# Altium project FMC_ADC_128CH_10B.PrjPCB (part 4 of 4)

## Sheet SPI_translators.SchDoc: FMC ADC 128CH 10B
size 420 x 297 mm; Author: G.Kasprowicz; CompanyName: WUT ISE; DrawnBy: G.Kasprowicz; Organization: WUT ISE; Address1: PW ISE; Address2: Nowowiejska 15/19 00-665 Warsaw; Address3: gkasprow@gmail.com; DocumentNumber: 8; Revision: 1; SheetNumber: 8; SheetTotal: 9; ModifiedBy: -; CheckedDate: -; Title2: SPi translators; DivGrp: WUT ISE; Designer: G.Kasprowicz; ModifiedDate: -; ProjectName: Sensor Box
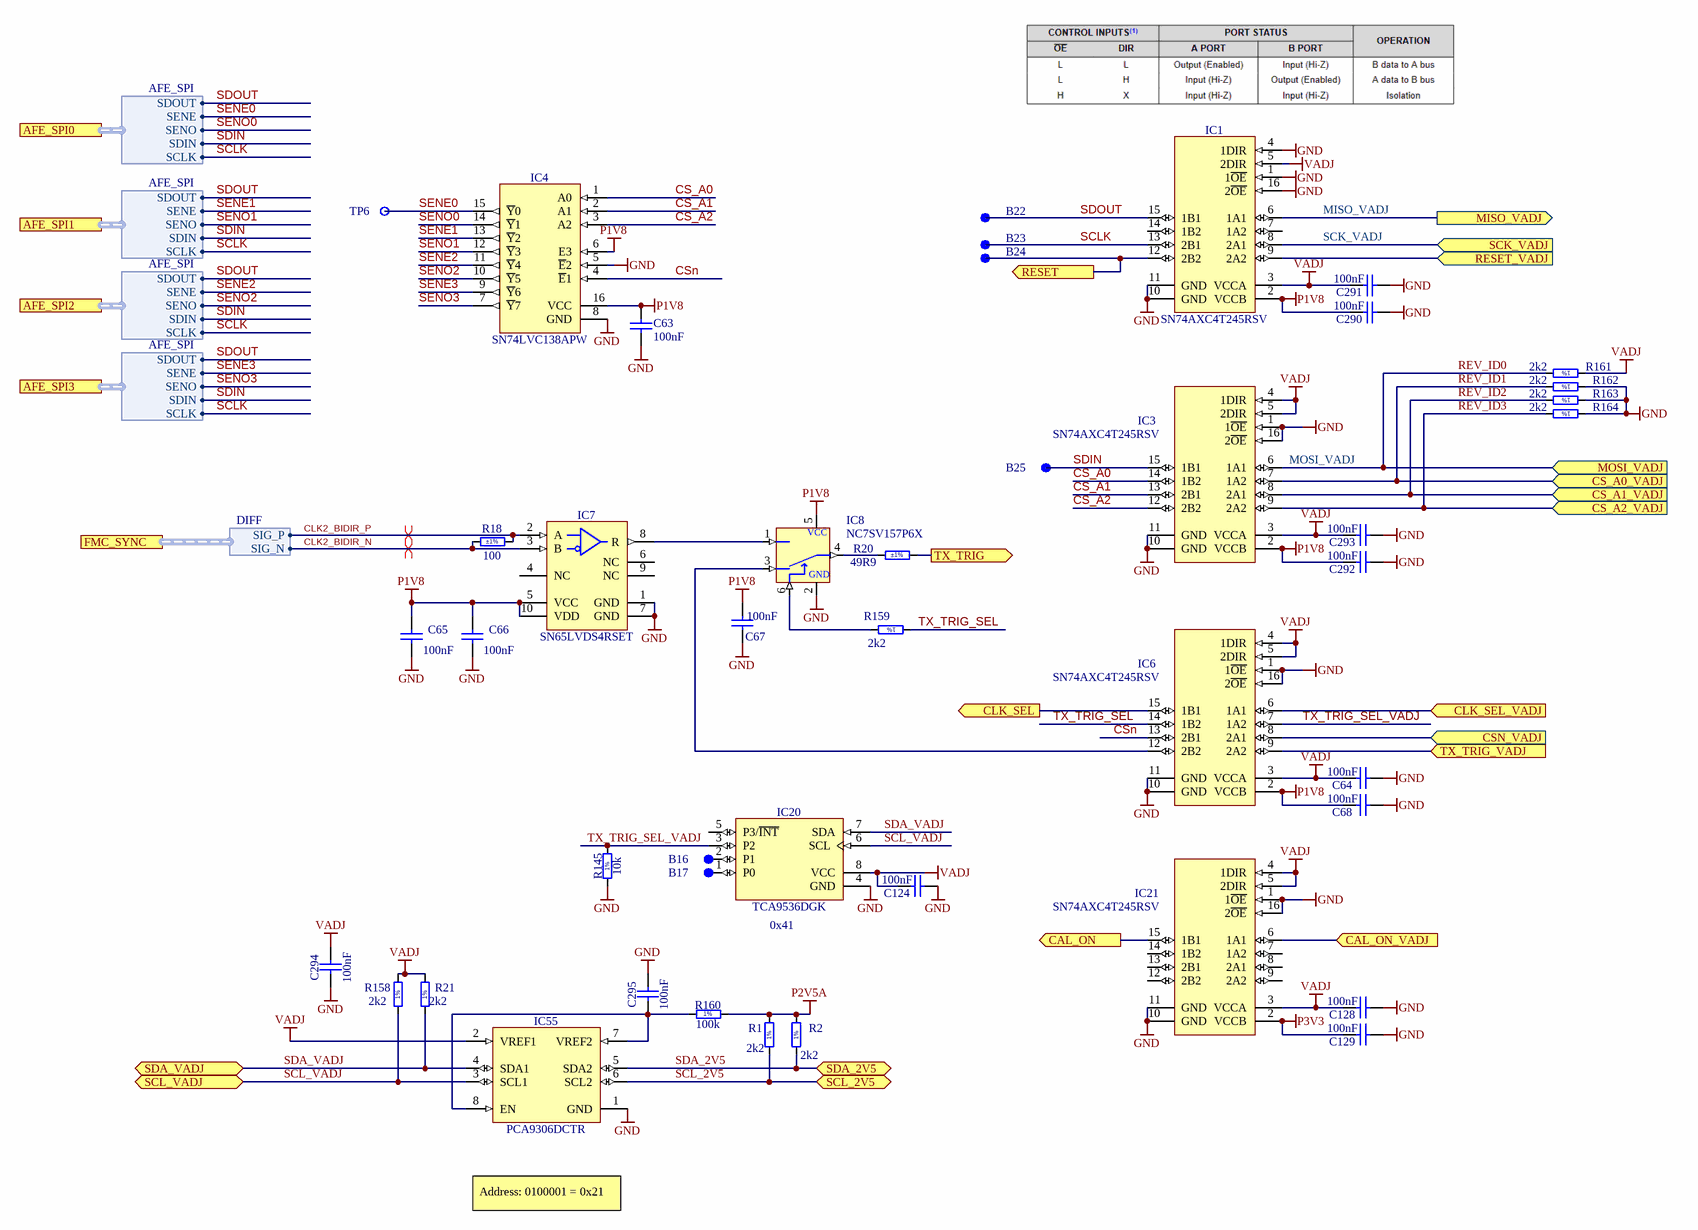
[diagram p7: SPI_translators.SchDoc]

### Parts
B16  SMD Pad  [C100]  (value not drawn)  (no BOM)
B17  SMD Pad  [C100]  (value not drawn)  (no BOM)
B22  SMD Pad  [C100]  (value not drawn)  (no BOM)
B23  SMD Pad  [C100]  (value not drawn)  (no BOM)
B24  SMD Pad  [C100]  (value not drawn)  (no BOM)
B25  SMD Pad  [C100]  (value not drawn)  (no BOM)
C63  100nF  [CAPC1005X55N]
C64  100nF  [CAPC0603X33N]
C65  100nF  [CAPC0603X33N]
C66  100nF  [CAPC0603X33N]
C67  100nF  [CAPC0603X33N]
C68  100nF  [CAPC0603X33N]
C124  100nF  [CAPC0603X33N]
C128  100nF  [CAPC0603X33N]
C129  100nF  [CAPC0603X33N]
C290  100nF  [CAPC0603X33N]
C291  100nF  [CAPC0603X33N]
C292  100nF  [CAPC0603X33N]
C293  100nF  [CAPC0603X33N]
C294  100nF  [CAPC0603X33N]
C295  100nF  [CAPC0603X33N]
IC1  SN74AXC4T245RSV  [QFN40P180X260X55-16N]
IC3  SN74AXC4T245RSV  [QFN40P180X260X55-16N]
IC4  SN74LVC138APW  [SOP65P640X110-16N]
IC6  SN74AXC4T245RSV  [QFN40P180X260X55-16N]
IC7  SN65LVDS4RSET  [TEXAS_RSE (R-PUQFN-N10)]
IC8  NC7SV157P6X  [SC70-6]
IC20  TCA9536DGK  [SOP65P490X110-8N]
IC21  SN74AXC4T245RSV  [QFN40P180X260X55-16N]
IC55  PCA9306DCTR  [SOP65P400X130-8N]
R1  2k2  [RESC1005X40N]
R2  2k2  [RESC1005X40N]
R18  100  Tolerance: ±1%  [RESC1005X40N]
R20  49R9  Tolerance: ±1%  [RESC1005X40N]
R21  2k2  [RESC1005X40N]
R145  10k  [RESC1005X40N]
R158  2k2  [RESC1005X40N]
R159  2k2  [RESC1005X40N]
R160  100k  [RESC1005X40N]
R161  2k2  [RESC1005X40N]
R162  2k2  [RESC1005X40N]
R163  2k2  [RESC1005X40N]
R164  2k2  [RESC1005X40N]
TP6  Test Point  [TPS127]  (value not drawn)  (no BOM)

### Ports
AFE_SPI0 (harness AFE_SPI), AFE_SPI1 (harness AFE_SPI), AFE_SPI2 (harness AFE_SPI), AFE_SPI3 (harness AFE_SPI), CAL_ON (out), CAL_ON_VADJ (in), CLK_SEL (out), CLK_SEL_VADJ (in), CS_A0_VADJ (in), CS_A1_VADJ (in), CS_A2_VADJ (in), CSN_VADJ (in), FMC_SYNC (harness DIFF), MISO_VADJ (out), MOSI_VADJ (in), RESET (out), RESET_VADJ (in), SCK_VADJ (in), SCL_2V5 (bidir), SCL_VADJ (bidir), SDA_2V5 (bidir), SDA_VADJ (bidir), TX_TRIG (out), TX_TRIG_VADJ (in)

### Harnesses
AFE_SPI: SDOUT, SENE, SENO, SDIN, SCLK
DIFF: SIG_P, SIG_N

### Nets
GND: C63.1 C64.2 C65.2 C66.2 C67.1 C68.2 C124.2 C128.2 C129.2 C290.2 C291.2 C292.2 C293.2 C294.1 C295.2 IC1.1(1~{OE}) IC1.4(1DIR) IC1.10(GND) IC1.11(GND) IC1.16(2~{OE}) IC3.1(1~{OE}) IC3.10(GND) IC3.11(GND) IC3.16(2~{OE}) IC4.5(~{E}2) IC4.8(GND) IC6.1(1~{OE}) IC6.10(GND) IC6.11(GND) IC6.16(2~{OE}) IC7.1(GND) IC7.7(GND) IC8.2(GND) IC20.4(GND) IC21.1(1~{OE}) IC21.10(GND) IC21.11(GND) IC21.16(2~{OE}) IC55.1(GND) R145.1 R162.1 R163.1 R164.1
P1V8: C63.2 C65.1 C66.1 C67.2 C68.1 C290.1 C292.1 IC1.2(VCCB) IC3.2(VCCB) IC4.6(E3) IC4.16(VCC) IC6.2(VCCB) IC7.5(VCC) IC7.10(VDD) IC8.5(Vcc)
P2V5A: R1.2 R2.2 R160.2
P3V3: C129.1 IC21.2(VCCB)
VADJ: C64.1 C124.1 C128.1 C291.1 C293.1 C294.2 IC1.3(VCCA) IC1.5(2DIR) IC3.3(VCCA) IC3.4(1DIR) IC3.5(2DIR) IC6.3(VCCA) IC6.4(1DIR) IC6.5(2DIR) IC20.8(VCC) IC21.3(VCCA) IC21.4(1DIR) IC21.5(2DIR) IC55.2(VREF1) R21.2 R158.2 R161.1
CAL_ON: IC21.15(1B1) ; port CAL_ON
CLK2_BIDIR_N: IC7.3(B) R18.1 ; port FMC_SYNC.SIG_N
CLK2_BIDIR_P: IC7.2(A) R18.2 ; port FMC_SYNC.SIG_P
CLK_SEL: IC6.15(1B1) ; port CLK_SEL
CS_A0: IC3.14(1B2) IC4.1(A0)
CS_A1: IC3.13(2B1) IC4.2(A1)
CS_A2: IC3.12(2B2) IC4.3(A2)
CSn: IC4.4(~{E}1) IC6.13(2B1)
HA19_P: IC6.8(2A1) ; port CSN_VADJ
HA22_N: IC1.9(2A2) ; port RESET_VADJ
HA23_P: IC6.9(2A2) ; port TX_TRIG_VADJ
HB20_N: IC21.6(1A1) ; port CAL_ON_VADJ
HB21_P: IC6.6(1A1) ; port CLK_SEL_VADJ
MISO_VADJ: IC1.6(1A1) ; port MISO_VADJ  [project net HA22_P]
MOSI_VADJ: IC3.6(1A1) R161.2 ; port MOSI_VADJ  [also labelled REV_ID0]  [project net HA21_P]
RESET: B24.1 IC1.12(2B2) ; port RESET
REV_ID1: IC3.7(1A2) R162.2 ; port CS_A0_VADJ  [project net HA19_N]
REV_ID2: IC3.8(2A1) R163.2 ; port CS_A1_VADJ  [project net HA20_P]
REV_ID3: IC3.9(2A2) R164.2 ; port CS_A2_VADJ  [project net HA20_N]
SCK_VADJ: IC1.8(2A1) ; port SCK_VADJ  [project net HA21_N]
SCL_2V5: IC55.6(SCL2) R1.1 ; port SCL_2V5
SCL_VADJ: IC20.6(SCL) IC55.3(SCL1) R158.1 ; port SCL_VADJ  [project net HB21_N]
SCLK: B23.1 IC1.13(2B1) ; port AFE_SPI0.SCLK, port AFE_SPI1.SCLK, port AFE_SPI2.SCLK, port AFE_SPI3.SCLK
SDA_2V5: IC55.5(SDA2) R2.1 ; port SDA_2V5
SDA_VADJ: IC20.7(SDA) IC55.4(SDA1) R21.1 ; port SDA_VADJ  [project net HB20_P]
SDIN: B25.1 IC3.15(1B1) ; port AFE_SPI0.SDIN, port AFE_SPI1.SDIN, port AFE_SPI2.SDIN, port AFE_SPI3.SDIN
SDOUT: B22.1 IC1.15(1B1) ; port AFE_SPI0.SDOUT, port AFE_SPI1.SDOUT, port AFE_SPI2.SDOUT, port AFE_SPI3.SDOUT
SENE0: IC4.15(~{Y}0) TP6.1 ; port AFE_SPI0.SENE  [project net SENE]
SENE1: IC4.13(~{Y}2) ; port AFE_SPI1.SENE  [project net SENE]
SENE2: IC4.11(~{Y}4) ; port AFE_SPI2.SENE  [project net SENE]
SENE3: IC4.9(~{Y}6) ; port AFE_SPI3.SENE  [project net SENE]
SENO0: IC4.14(~{Y}1) ; port AFE_SPI0.SENO  [project net SENO]
SENO1: IC4.12(~{Y}3) ; port AFE_SPI1.SENO  [project net SENO]
SENO2: IC4.10(~{Y}5) ; port AFE_SPI2.SENO  [project net SENO]
SENO3: IC4.7(~{Y}7) ; port AFE_SPI3.SENO  [project net SENO]
TX_TRIG: R20.2 ; port TX_TRIG
TX_TRIG_SEL: IC6.14(1B2) R159.1
TX_TRIG_SEL_VADJ: IC6.7(1A2) IC20.3(P2) R145.2
NetB16_1: B16.1 IC20.2(P1)
NetB17_1: B17.1 IC20.1(P0)
NetC295_1: C295.1 IC55.7(VREF2) IC55.8(EN) R160.1
NetIC6_12: IC6.12(2B2) IC8.3(I0)
NetIC7_8: IC7.8(R) IC8.1(I1)
NetIC8_4: IC8.4(Z) R20.1
NetIC8_6: IC8.6(S) R159.2

Not connected (* = marked no-connect by the designer): IC1 7(1A2) 14(1B2); IC7 4(NC) 6(NC) 9(NC); IC20 5(P3/~{INT}); IC21 7(1A2) 8(2A1) 9(2A2) 12(2B2) 13(2B1) 14(1B2)

### Layout directives
differential pair: CLK2_BIDIR_N, CLK2_BIDIR_P

### Notes on the sheet
- (near IC20) 0x41
- Address: 0100001 = 0x21
- Project/Equipment
- Document
- Designer
- Drawn by
- Check.by
- Copyright WUT ISE 2018.
  This documentation describes Open Hardware and is licensed under the CERN OHL v.1.1. You may redistribute and modify this documentation under the terms of the CERN OHL v.1.1. (http://ohwr.org/CERNOHL). This documentation is distributed WITHOUT ANY EXPRESS OR IMPLIED WARRANTY, INCLUDING OF MERCHANTABILITY, SATISFACTORY QUALITY AND FITNESS FOR A PARTICULAR PURPOSE. Please see the CERN OHL v.1.1 for applicable conditions.
- Contact
- File
- Last Mod.
- Print Date
- Sheet
- Size
- A3
- of
- Rev
- (in symbol 74_NC7SV157P6X) VCC
- (in symbol R0402_2K2_1%_0.0625W_100PPM) 1%
- (in symbol R0402_10K_1%_0.0625W_100PPM) 1%
- (in symbol R0402_100K_1%_0.0625W_100PPM) 1%

### Library data of the parts
B16 B17 B22-B25 = SMD_PAD_D1MM: Through Hole Pad; Part Description: 1mm Diameter SMD Pad; Mounted: No; Part Number: SMD_PAD_D1MM; Component Type: Standard (No BOM); Pin Count: 1; Family: SMD Pad; Socket: No; SMD: No; Sense: No; Status: None; ComponentHeight: 0mm; HelpURL: Undefined; Author: CERN DEM JLC; CreateDate: 10.10.2017; LatestRevisionDate: 10.10.2017; PackageDescription: 1mm Diameter SMD Pad
C63 = CC0402_100NF_16V_10%_X5R: Non-polarised capacitor; Part Description: SMD Multilayer Chip Ceramic Capacitor; Manufacturer: GENERIC; Manufacturer1 Part Number: GRM155R61C104KA88D; Voltage: 16V; TC: X5R; Tolerance: ±10%; Part Number: CC0402_100NF_16V_10%_X5R; Component Kind: Standard; Component Type: Standard; Pin Count: 2; Value: 100nF; Status: None; Manufacturer Part Number: CC0402_100NF_16V_10%_X5R; Case: 0402; Mounted: Yes; Socket: No; SMD: Yes; Sense: No; Manufacturer1 Example: MURATA; Manufacturer1 ComponentHeight: 0.55mm; HelpURL: \\cern.ch\dfs\Applications\Altium\Datasheets\CC0402_X5R_MURATA_GRM.pdf; Author: CERN DEM JLC; CreateDate: 10.12.2013; LatestRevisionDate: 10.12.2013
C64-C68 C124 C128 C129 C290-C295 = CC0201_100NF_6.3V_10%_X5R: Non-polarised capacitor; Manufacturer: GENERIC; Part Description: SMD Multilayer Chip Ceramic Capacitor; Manufacturer1 Part Number: 02016D104KAT2A; Tolerance: ±10%; Voltage: 6.3V; TC: X5R; Manufacturer Part Number: CC0201_100NF_6.3V_10%_X5R; Part Number: CC0201_100NF_6.3V_10%_X5R; Value: 100nF; Component Kind: Standard; Component Type: Standard; Pin Count: 2; Status: Not Recommended; Case: 0201; Mounted: Yes; Socket: No; SMD: Yes; Sense: No; Manufacturer1 Example: AVX; Manufacturer1 ComponentHeight: 0.33mm; HelpURL: \\cern.ch\dfs\Applications\Altium\Datasheets\CC0201_X5R_AVX.pdf; Author: CERN DEM JLC; CreateDate: 03.12.2007; LatestRevisionDate: 03.12.2007
IC1 IC3 IC6 IC21 = SN74AXC4T245: 4-Bit Dual-Supply Bus Transceiver with Configurable Voltage Translation and 3-State Output; Part Description: 4-Bit Dual-Supply Bus Transceiver With Configurable Voltage Translation and 3-State Outputs; Manufacturer: TEXAS INSTRUMENTS; PressFit: No; Bonding: No; Part Number: SN74AXC4T245RSV; Component Kind: Standard; Component Type: Standard; Device: SN74AXC4T245RSV; PackageDescription: QFN, 0.40mm Pitch, Rect.; 16 Pin, 2.60mm L X 1.80mm W X 0.55mm H Body, IPC Medium Density; Status: Recommended; Manufacturer Part Number: SN74AXC4T245RSV; Pin Count: 16; Case: QFN16; Mounted: Yes; Socket: No; SMD: Yes; Sense: No; ComponentHeight: 0.55mm; Author: GK; HelpURL: \\cern.ch\dfs\Applications\Altium\Datasheets\SN74AVC4T245RSVR.pdf; CreateDate: 08.07.2014; LatestRevisionDate: 30.03.2017
IC4 = SN74LVC138APW: 3-Line to 8-Line Decoder/Demultiplexer; Part Description: 3-Line to 8-Line Decoder/Demultiplexer, Inverting; Manufacturer: Texas Instruments; PressFit: No; Bonding: No; Part Number: SN74LVC138APW; Component Kind: Standard; Component Type: Standard; Device: SN74LVC138APW; PackageDescription: SOP, 0.65mm pitch; 16 pin, 4.40mm W X 5.00mm L X 1.10mm H body IPC Medium Density; Manufacturer Part Number: SN74LVC138APW; Pin Count: 16; Case: TSSOP16; Mounted: Yes; Socket: No; SMD: Yes; Sense: No; ComponentHeight: 1.1mm; Author: GK; HelpURL: \\cern.ch\dfs\Applications\Altium\Datasheets\74HC138PW.pdf; CreateDate: 09/06/2015; LatestRevisionDate: 09/06/2015
IC7 = SN65LVDS4RSET: 1.8V High-Speed Differential Line Receiver; Manufacturer: TEXAS INSTRUMENTS; PressFit: No; Bonding: No; Part Number: SN65LVDS4RSET; Component Kind: Standard; Component Type: Standard; Device: SN65LVDS4RSET; PackageDescription: QFN, TEXAS Case Style RSE (R-PUQFN-N10), 0.50mm Pitch; 10 Pin, 1.50mm W  X 2.00mm L X 0.60mm H body; Part Description: 1.8V High-Speed Differential Line Receiver; Manufacturer Part Number: SN65LVDS4RSET; Pin Count: 10; Case: QFN10; Mounted: Yes; Socket: No; SMD: Yes; Sense: No; ComponentHeight: 0.6mm; Author: CERN DEM JMW; HelpURL: \\cern.ch\dfs\Applications\Altium\Datasheets\SN65LVDS4RSET.pdf; CreateDate: 14.09.2015; LatestRevisionDate: 14.09.2015
IC8 = 74_NC7SV157P6X: TinyLogic ULP-A 2-Input Non-Inverting Multiplexer
IC20 = TCA9536DGK: Remote 4-Bit I2C and SMBus I/O Expander with Configuration Registers; Manufacturer: TEXAS INSTRUMENTS; PressFit: No; Bonding: No; Part Number: TCA9536DGK; Component Kind: Standard; Component Type: Standard; Device: TCA9536DGK; PackageDescription: SOP, 0.65mm Pitch; 8 Pin, 3.00mm W X 3.00mm L X 1.10mm H body, IPC Medium Density; Part Description: Remote 4-Bit I2C and SMBus I/O Expander with Configuration Registers; Manufacturer Part Number: TCA9536DGK; Pin Count: 8; Case: TSSOP8; Mounted: Yes; Socket: No; SMD: Yes; Sense: No; ComponentHeight: 1.1mm; Author: CERN DEM HF; HelpURL: \\cern.ch\dfs\Applications\Altium\Datasheets\TCA9536A.pdf; CreateDate: 20.01.2025; LatestRevisionDate: 20.01.2025
IC55 = PCA9306DCTR: Dual Bidirectional I2C Bus And SMBus Voltage-Level Translator; Manufacturer: TEXAS INSTRUMENTS; Table: Analog & Interface; Part Number: PCA9306DCTR; Component Kind: Standard; Component Type: Standard; Device: PCA9306DCTR; PackageDescription: SOP, 0.65mm, Pitch; 8 Pin, 2.80mm W X 2.95mm L X 1.30mm H Body, PC Medium Density; Part Description: Dual Bidirectional I2C Bus And SMBus Voltage-Level Translator; Manufacturer Part Number: PCA9306DCTR; Pin Count: 8; Case: SSOP8; Mounted: Yes; Socket: No; SMD: Yes; ComponentHeight: 1.3mm; Author: CERN DEM JLC; HelpURL: \\cern.ch\dfs\Applications\Altium\Datasheets\PCA9306DCTR.pdf; CreateDate: 2013-02-25; LatestRevisionDate: 2013-02-25
R1 R2 R21 R158 R159 R161-R164 = R0402_2K2_1%_0.0625W_100PPM: Resistor - 1%; Part Description: General Purpose Thick Film Chip Resistor; Manufacturer: GENERIC; Manufacturer1 Part Number: 232270672202L; TC: ±100ppm/°C; Table: Resistors SMD; Part Number: R0402_2K2_1%_0.0625W_100PPM; Component Kind: Standard; Component Type: Standard; Pin Count: 2; Value: 2k2; Status: Not recommended; Power: 0.0625W; Tolerance: ±1%; Manufacturer Part Number: R0402_2K2_1%_0.0625W_100PPM; Case: 0402; Mounted: Yes; Socket: No; SMD: Yes; Manufacturer1 Example: YAGEO PHYCOMP; Manufacturer1 ComponentHeight: 0.4mm; HelpURL: \\cern.ch\dfs\Applications\Altium\Datasheets\R0402_Phycomp_RC0402.pdf; Author: CERN DEM JLC; CreateDate: 2007-12-03; LatestRevisionDate: 2012-10-17
R18 = R0402_100R_1%_0.0625W_100PPM: Resistor - 1%; Part Description: General Purpose Thick Film Chip Resistor; Manufacturer: GENERIC; Manufacturer1 Part Number: 232270671001L; TC: ±100ppm/°C; PressFit: No; Part Number: R0402_100R_1%_0.0625W_100PPM; Component Kind: Standard; Component Type: Standard; Pin Count: 2; Value: 100; Status: Not Recommended; Power: 0.0625W; Manufacturer Part Number: R0402_100R_1%_0.0625W_100PPM; Case: 0402; Mounted: Yes; Sense: No; Socket: No; SMD: Yes; Manufacturer1 Example: YAGEO PHYCOMP; Manufacturer1 ComponentHeight: 0.4mm; HelpURL: \\cern.ch\dfs\Applications\Altium\Datasheets\R0402_Phycomp_RC0402.pdf; Author: CERN DEM JLC; CreateDate: 03.12.2007; LatestRevisionDate: 17.10.2012
R20 = R0402_49R9_1%_0.0625W_100PPM: Resistor - 1%; Part Description: General Purpose Thick Film Chip Resistor; Manufacturer: GENERIC; Manufacturer1 Part Number: 232270674999L or RC0402FR-0749R9L; TC: ±100ppm/°C; PressFit: No; Part Number: R0402_49R9_1%_0.0625W_100PPM; Component Kind: Standard; Component Type: Standard; Pin Count: 2; Value: 49R9; Status: Not Recommended; Power: 0.0625W; Manufacturer Part Number: R0402_49R9_1%_0.0625W_100PPM; Case: 0402; Mounted: Yes; Sense: No; Socket: No; SMD: Yes; Manufacturer1 Example: YAGEO PHYCOMP; Manufacturer1 ComponentHeight: 0.4mm; HelpURL: \\cern.ch\dfs\Applications\Altium\Datasheets\R0402_Phycomp_RC0402.pdf; Author: CERN DEM JLC; CreateDate: 24.10.2012; LatestRevisionDate: 24.10.2012
R145 = R0402_10K_1%_0.0625W_100PPM: Resistor - 1%; Part Description: General Purpose Thick Film Chip Resistor; Manufacturer: GENERIC; Manufacturer1 Part Number: 232270671003L; TC: ±100ppm/°C; Table: Resistors SMD; Part Number: R0402_10K_1%_0.0625W_100PPM; Component Kind: Standard; Component Type: Standard; Pin Count: 2; Value: 10k; Status: Not recommended; Power: 0.0625W; Tolerance: ±1%; Manufacturer Part Number: R0402_10K_1%_0.0625W_100PPM; Case: 0402; Mounted: Yes; Socket: No; SMD: Yes; Manufacturer1 Example: YAGEO PHYCOMP; Manufacturer1 ComponentHeight: 0.4mm; HelpURL: \\cern.ch\dfs\Applications\Altium\Datasheets\R0402_Phycomp_RC0402.pdf; Author: CERN DEM JLC; CreateDate: 3/12/2007; LatestRevisionDate: 17/10/2012
R160 = R0402_100K_1%_0.0625W_100PPM: Resistor - 1%; Part Description: General Purpose Thick Film Chip Resistor; Manufacturer: GENERIC; Manufacturer1 Part Number: 232270671004L; TC: ±100ppm/°C; Table: Resistors SMD; Part Number: R0402_100K_1%_0.0625W_100PPM; Component Kind: Standard; Component Type: Standard; Pin Count: 2; Value: 100k; Status: Not recommended; Power: 0.0625W; Tolerance: ±1%; Manufacturer Part Number: R0402_100K_1%_0.0625W_100PPM; Case: 0402; Mounted: Yes; Socket: No; SMD: Yes; Manufacturer1 Example: YAGEO PHYCOMP; Manufacturer1 ComponentHeight: 0.4mm; HelpURL: \\cern.ch\dfs\Applications\Altium\Datasheets\R0402_Phycomp_RC0402.pdf; Author: CERN DEM JLC; CreateDate: 2007-12-03; LatestRevisionDate: 2012-10-17
TP6 = SMD_PAD_1.27X1.27MM: Part Description: 1.27mm x 1.27mm PCB Copper Area (SMD Test Point); Mounted: No; Part Number: SMD_PAD_1.27X1.27MM; Component Type: Standard (No BOM); Pin Count: 1; Family: Test Point; Socket: No; SMD: Yes; Sense: No; Status: None; ComponentHeight: 0mm; HelpURL: Undefined; Author: CERN DEM JLC; CreateDate: 12.01.2008; LatestRevisionDate: 12.01.2008; PackageDescription: 1.27mm x 1.27mm PCB Copper Area (SMD Test Point)

## Sheet FlyOver_connector.SchDoc: FMC ADC 128CH 10B
size 420 x 297 mm; Author: G.Kasprowicz; CompanyName: WUT ISE; DrawnBy: G.Kasprowicz; Organization: WUT ISE; Address1: PW ISE; Address2: Nowowiejska 15/19 00-665 Warsaw; Address3: gkasprow@gmail.com; DocumentNumber: 9; Revision: 1; SheetNumber: 9; SheetTotal: 9; ModifiedBy: -; CheckedDate: -; Title2: FlyOver connector; DivGrp: WUT ISE; Designer: G.Kasprowicz; ModifiedDate: -; ProjectName: Sensor Box
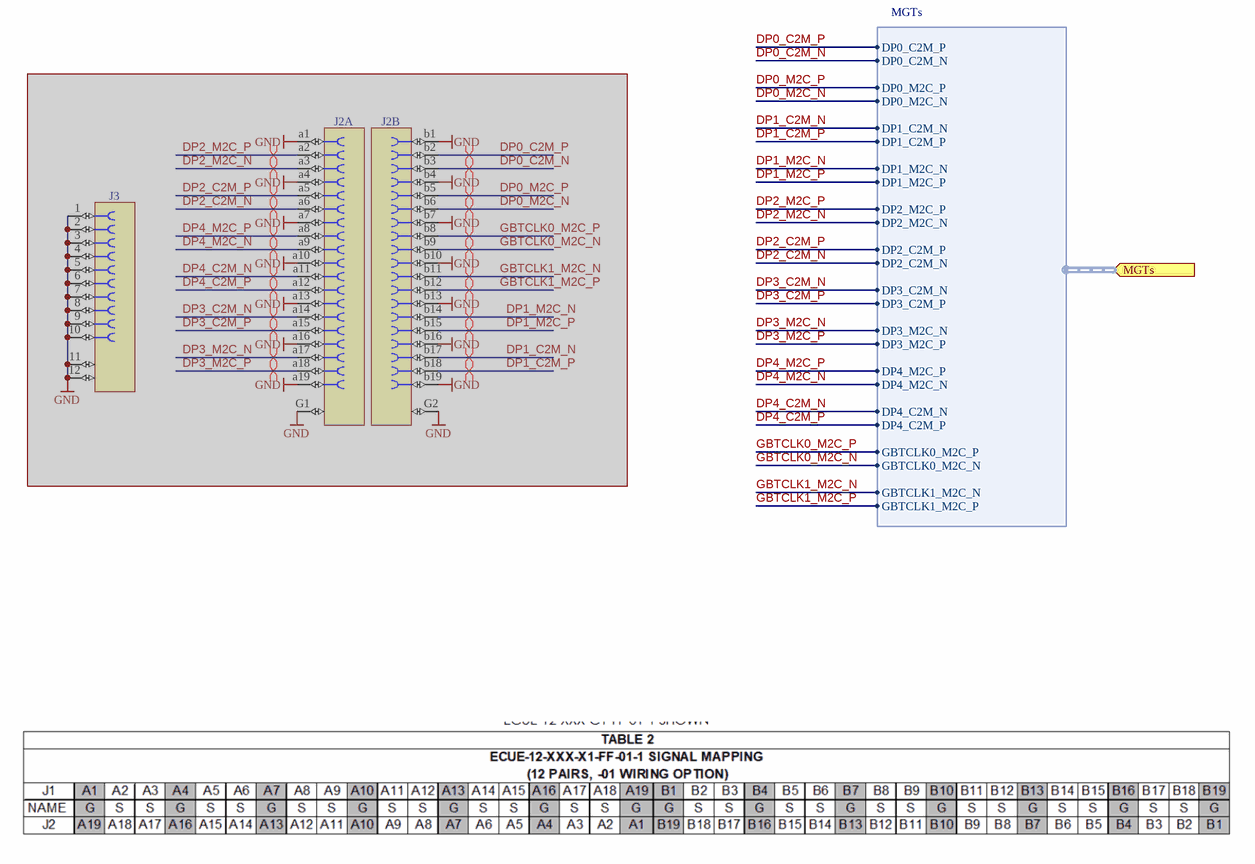
[diagram p8: FlyOver_connector.SchDoc]

### Parts
(Parts that share a designator on the sheet are numbered #1, #2 ... from top to bottom, then left to right.)
J2#2  Socket 38  [SAMTEC_UEC5-019-1-H-D-RA-1-A]  (value not drawn)  (parts A,B of 2)  (masked out: inside a compile mask, not in the netlist)
J3  Socket 10  [SAMTEC_UCC8-010-1-H-S-1-A]  (value not drawn)  (masked out: inside a compile mask, not in the netlist)

### Ports
MGTs (in, harness MGTs)

### Harnesses
MGTs: DP0_C2M_P, DP0_M2C_P, DP0_M2C_N, DP1_M2C_N, DP1_M2C_P, DP0_C2M_N, DP1_C2M_N, DP1_C2M_P, DP2_M2C_P, DP2_M2C_N, DP2_C2M_P, DP2_C2M_N, DP3_C2M_N, DP3_C2M_P, DP3_M2C_N, DP3_M2C_P, DP4_M2C_P, DP4_M2C_N, DP4_C2M_N, DP4_C2M_P, GBTCLK0_M2C_P, GBTCLK0_M2C_N, GBTCLK1_M2C_N, GBTCLK1_M2C_P

### Layout directives
differential pair: (no net found under the mark)

### Notes on the sheet
- Project/Equipment
- Document
- Designer
- Drawn by
- Check.by
- Copyright WUT ISE 2018.
  This documentation describes Open Hardware and is licensed under the CERN OHL v.1.1. You may redistribute and modify this documentation under the terms of the CERN OHL v.1.1. (http://ohwr.org/CERNOHL). This documentation is distributed WITHOUT ANY EXPRESS OR IMPLIED WARRANTY, INCLUDING OF MERCHANTABILITY, SATISFACTORY QUALITY AND FITNESS FOR A PARTICULAR PURPOSE. Please see the CERN OHL v.1.1 for applicable conditions.
- Contact
- File
- Last Mod.
- Print Date
- Sheet
- Size
- A3
- of
- Rev

### Library data of the parts
J2#2 = SAMTEC_UEC5-019-1-H-D-RA-1-A: Connector 38ab Female (2x19) + 2x1; Part Description: 38 Contacts, Pitch 0.5mm, Rugged Micro Flyover Socket System; Manufacturer: SAMTEC; PressFit: No; Part Number: SAMTEC_UEC5-019-1-H-D-RA-1-A; Component Kind: Standard; Component Type: Standard; Pin Count: 38; Family: Socket 38; Mounted: Yes; Socket: No; SMD: Yes; Sense: No; Status: None; Manufacturer Part Number: UEC5-019-1-H-D-RA-1-A; ComponentHeight: 3.31mm; HelpURL: \\cern.ch\dfs\Applications\Altium\Datasheets\SAMTEC_UEC5-019-1-H-D-RA-1-A.pdf; Author: CERN DEM JLC; CreateDate: 09.06.2015; LatestRevisionDate: 15.06.2015
J3 = SAMTEC_UCC8-010-1-H-S-1-A: Connector 10 Female + 2; Part Description: 10 Contacts, Pitch 0.8mm, Rugged Micro Flyover Socket System; Manufacturer: SAMTEC; PressFit: No; Part Number: SAMTEC_UCC8-010-1-H-S-1-A; Component Kind: Standard; Component Type: Standard; Pin Count: 10; Family: Socket 10; Mounted: Yes; Socket: No; SMD: Yes; Sense: No; Status: None; Manufacturer Part Number: UCC8-010-1-H-S-1-A; ComponentHeight: 3.95mm; HelpURL: \\cern.ch\dfs\Applications\Altium\Datasheets\SAMTEC_UCC8-010-1-H-S-1-A.pdf; Author: CERN DEM JLC; CreateDate: 09.06.2015; LatestRevisionDate: 09.06.2015

## Nets that join several sheets
3P3VAUX: FMC_ADC_128CH_10B (J1.41), FMC (J6.d32), EEPROM_Temp (11 pins)
GND: FMC_ADC_128CH_10B (44 pins), U_AFE_0 (32 pins), U_AFE_0/U_AFE_32_SUP (82 pins), Supply_FMC_ADC128 (111 pins), CLK_INPUT (15 pins), U_AFE_1 (32 pins), U_AFE_1/U_AFE_32_SUP (82 pins), U_AFE_2 (32 pins), U_AFE_2/U_AFE_32_SUP (82 pins), U_AFE_3 (32 pins), U_AFE_3/U_AFE_32_SUP (82 pins), FMC (164 pins), EEPROM_Temp (14 pins), SPI_translators (43 pins)
IN_N: U_AFE_0 (72 pins), Supply_FMC_ADC128 (7 pins), U_AFE_1 (72 pins), U_AFE_2 (72 pins), U_AFE_3 (72 pins)
P1V2D: U_AFE_0/U_AFE_32_SUP (33 pins), Supply_FMC_ADC128 (8 pins), U_AFE_1/U_AFE_32_SUP (33 pins), U_AFE_2/U_AFE_32_SUP (33 pins), U_AFE_3/U_AFE_32_SUP (33 pins)
P1V8: U_AFE_0 (U1A#1.K16), Supply_FMC_ADC128 (10 pins), U_AFE_1 (U1B#1.K16), U_AFE_2 (U1C#1.K16), U_AFE_3 (U1D#1.K16), SPI_translators (15 pins)
P1V8A: U_AFE_0/U_AFE_32_SUP (12 pins), Supply_FMC_ADC128 (L7.2 R123.2 T3.5 TP8.1), U_AFE_1/U_AFE_32_SUP (12 pins), U_AFE_2/U_AFE_32_SUP (12 pins), U_AFE_3/U_AFE_32_SUP (12 pins)
P1V8D: FMC_ADC_128CH_10B (5 pins), U_AFE_0/U_AFE_32_SUP (12 pins), Supply_FMC_ADC128 (L8.2 TP10.1), U_AFE_1/U_AFE_32_SUP (12 pins), U_AFE_2/U_AFE_32_SUP (12 pins), U_AFE_3/U_AFE_32_SUP (12 pins)
P1V9A: U_AFE_0/U_AFE_32_SUP (25 pins), Supply_FMC_ADC128 (14 pins), U_AFE_1/U_AFE_32_SUP (25 pins), U_AFE_2/U_AFE_32_SUP (25 pins), U_AFE_3/U_AFE_32_SUP (25 pins)
P2V5A: Supply_FMC_ADC128 (10 pins), CLK_INPUT (L4.1 L5.2), SPI_translators (R1.2 R2.2 R160.2)
P3V3: FMC_ADC_128CH_10B (6 pins), Supply_FMC_ADC128 (14 pins), CLK_INPUT (LD1.2), FMC (R132.1), SPI_translators (C129.1 IC21.2)
P3V3_FMC: Supply_FMC_ADC128 (6 pins), FMC (J6.c39 J6.d36 J6.d38 J6.d40)
P3V15A: U_AFE_0/U_AFE_32_SUP (8 pins), Supply_FMC_ADC128 (23 pins), U_AFE_1/U_AFE_32_SUP (8 pins), U_AFE_2/U_AFE_32_SUP (8 pins), U_AFE_3/U_AFE_32_SUP (8 pins)
P12V0: Supply_FMC_ADC128 (9 pins), FMC (J6.c35 J6.c37)
V_PROT: U_AFE_0 (16 pins), Supply_FMC_ADC128 (5 pins), U_AFE_1 (16 pins), U_AFE_2 (16 pins), U_AFE_3 (16 pins)
VADJ: Supply_FMC_ADC128 (IC22.8 R105.2), FMC (J6.e39 J6.f40 J6.g39 J6.h40), SPI_translators (22 pins)
ADC_CLK_N: U_AFE_0 (C9A.1 R17A.1), CLK_INPUT (IC5.17)
ADC_CLK_N: CLK_INPUT (IC5.3), U_AFE_3 (C9D.1 R17D.1)
ADC_CLK_N: CLK_INPUT (IC5.23), U_AFE_1 (C9B.1 R17B.1)
ADC_CLK_N: CLK_INPUT (IC5.27), U_AFE_2 (C9C.1 R17C.1)
ADC_CLK_P: U_AFE_0 (C5A.1 R17A.2), CLK_INPUT (IC5.16)
ADC_CLK_P: CLK_INPUT (IC5.2), U_AFE_3 (C5D.1 R17D.2)
ADC_CLK_P: CLK_INPUT (IC5.22), U_AFE_1 (C5B.1 R17B.2)
ADC_CLK_P: CLK_INPUT (IC5.26), U_AFE_2 (C5C.1 R17C.2)
CAL_ON: FMC_ADC_128CH_10B (J1.146), SPI_translators (IC21.15)
CLK2_BIDIR_N: FMC (J6.k5), SPI_translators (IC7.3 R18.1)
CLK2_BIDIR_P: FMC (J6.k4), SPI_translators (IC7.2 R18.2)
CLK3_BIDIR_N: CLK_INPUT (C24.1), FMC (J6.j3)
CLK3_BIDIR_P: CLK_INPUT (C23.1), FMC (J6.j2)
CLK_SEL: CLK_INPUT (T1.2 T1.5), SPI_translators (IC6.15)
DCLK_N: U_AFE_0 (U1A#1.U9), FMC (J6.e3)
DCLK_N: U_AFE_1 (U1B#1.U9), FMC (J6.k38)
DCLK_N: U_AFE_2 (U1C#1.U9), FMC (J6.k17)
DCLK_N: U_AFE_3 (U1D#1.U9), FMC (J6.k26)
DCLK_P: U_AFE_0 (U1A#1.T9), FMC (J6.e2)
DCLK_P: U_AFE_1 (U1B#1.T9), FMC (J6.k37)
DCLK_P: U_AFE_2 (U1C#1.T9), FMC (J6.k16)
DCLK_P: U_AFE_3 (U1D#1.T9), FMC (J6.k25)
DOUT0_N: U_AFE_0 (U1A#1.T16), FMC (J6.j13)
DOUT0_N: U_AFE_1 (U1B#1.T16), FMC (J6.g19)
DOUT0_N: U_AFE_2 (U1C#1.T16), FMC (J6.h38)
DOUT0_N: U_AFE_3 (U1D#1.T16), FMC (J6.f32)
DOUT0_P: U_AFE_0 (U1A#1.R16), FMC (J6.j12)
DOUT0_P: U_AFE_1 (U1B#1.R16), FMC (J6.g18)
DOUT0_P: U_AFE_2 (U1C#1.R16), FMC (J6.h37)
DOUT0_P: U_AFE_3 (U1D#1.R16), FMC (J6.f31)
DOUT1_N: U_AFE_0 (U1A#1.T15), FMC (J6.f17)
DOUT1_N: U_AFE_1 (U1B#1.T15), FMC (J6.d15)
DOUT1_N: U_AFE_2 (U1C#1.T15), FMC (J6.g37)
DOUT1_N: U_AFE_3 (U1D#1.T15), FMC (J6.e25)
DOUT1_P: U_AFE_0 (U1A#1.R15), FMC (J6.f16)
DOUT1_P: U_AFE_1 (U1B#1.R15), FMC (J6.d14)
DOUT1_P: U_AFE_2 (U1C#1.R15), FMC (J6.g36)
DOUT1_P: U_AFE_3 (U1D#1.R15), FMC (J6.e24)
DOUT2_N: U_AFE_0 (U1A#1.T14), FMC (J6.j10)
DOUT2_N: U_AFE_1 (U1B#1.T14), FMC (J6.c15)
DOUT2_N: U_AFE_2 (U1C#1.T14), FMC (J6.h35)
DOUT2_N: U_AFE_3 (U1D#1.T14), FMC (J6.j31)
DOUT2_P: U_AFE_0 (U1A#1.R14), FMC (J6.j9)
DOUT2_P: U_AFE_1 (U1B#1.R14), FMC (J6.c14)
DOUT2_P: U_AFE_2 (U1C#1.R14), FMC (J6.h34)
DOUT2_P: U_AFE_3 (U1D#1.R14), FMC (J6.j30)
DOUT3_N: U_AFE_0 (U1A#1.U13), FMC (J6.e16)
DOUT3_N: U_AFE_1 (U1B#1.U13), FMC (J6.h14)
DOUT3_N: U_AFE_2 (U1C#1.U13), FMC (J6.h32)
DOUT3_N: U_AFE_3 (U1D#1.U13), FMC (J6.j37)
DOUT3_P: U_AFE_0 (U1A#1.T13), FMC (J6.e15)
DOUT3_P: U_AFE_1 (U1B#1.T13), FMC (J6.h13)
DOUT3_P: U_AFE_2 (U1C#1.T13), FMC (J6.h31)
DOUT3_P: U_AFE_3 (U1D#1.T13), FMC (J6.j36)
DOUT4_N: U_AFE_0 (U1A#1.U12), FMC (J6.j19)
DOUT4_N: U_AFE_1 (U1B#1.U12), FMC (J6.d12)
DOUT4_N: U_AFE_2 (U1C#1.U12), FMC (J6.g31)
DOUT4_N: U_AFE_3 (U1D#1.U12), FMC (J6.e28)
DOUT4_P: U_AFE_0 (U1A#1.T12), FMC (J6.j18)
DOUT4_P: U_AFE_1 (U1B#1.T12), FMC (J6.d11)
DOUT4_P: U_AFE_2 (U1C#1.T12), FMC (J6.g30)
DOUT4_P: U_AFE_3 (U1D#1.T12), FMC (J6.e27)
DOUT5_N: U_AFE_0 (U1A#1.R11), FMC (J6.j7)
DOUT5_N: U_AFE_1 (U1B#1.R11), FMC (J6.h20)
DOUT5_N: U_AFE_2 (U1C#1.R11), FMC (J6.g34)
DOUT5_N: U_AFE_3 (U1D#1.R11), FMC (J6.e34)
DOUT5_P: U_AFE_0 (U1A#1.R12), FMC (J6.j6)
DOUT5_P: U_AFE_1 (U1B#1.R12), FMC (J6.h19)
DOUT5_P: U_AFE_2 (U1C#1.R12), FMC (J6.g33)
DOUT5_P: U_AFE_3 (U1D#1.R12), FMC (J6.e33)
DOUT6_N: U_AFE_0 (U1A#1.U11), FMC (J6.f5)
DOUT6_N: U_AFE_1 (U1B#1.U11), FMC (J6.g13)
DOUT6_N: U_AFE_2 (U1C#1.U11), FMC (J6.h29)
DOUT6_N: U_AFE_3 (U1D#1.U11), FMC (J6.j34)
DOUT6_P: U_AFE_0 (U1A#1.T11), FMC (J6.f4)
DOUT6_P: U_AFE_1 (U1B#1.T11), FMC (J6.g12)
DOUT6_P: U_AFE_2 (U1C#1.T11), FMC (J6.h28)
DOUT6_P: U_AFE_3 (U1D#1.T11), FMC (J6.j33)
DOUT7_N: U_AFE_0 (U1A#1.U10), FMC (J6.j16)
DOUT7_N: U_AFE_1 (U1B#1.U10), FMC (J6.c11)
DOUT7_N: U_AFE_2 (U1C#1.U10), FMC (J6.g28)
DOUT7_N: U_AFE_3 (U1D#1.U10), FMC (J6.e31)
DOUT7_P: U_AFE_0 (U1A#1.T10), FMC (J6.j15)
DOUT7_P: U_AFE_1 (U1B#1.T10), FMC (J6.c10)
DOUT7_P: U_AFE_2 (U1C#1.T10), FMC (J6.g27)
DOUT7_P: U_AFE_3 (U1D#1.T10), FMC (J6.e30)
DOUT8_N: U_AFE_0 (U1A#1.U8), FMC (J6.k14)
DOUT8_N: U_AFE_1 (U1B#1.U8), FMC (J6.h11)
DOUT8_N: U_AFE_2 (U1C#1.U8), FMC (J6.d27)
DOUT8_N: U_AFE_3 (U1D#1.U8), FMC (J6.k35)
DOUT8_P: U_AFE_0 (U1A#1.T8), FMC (J6.k13)
DOUT8_P: U_AFE_1 (U1B#1.T8), FMC (J6.h10)
DOUT8_P: U_AFE_2 (U1C#1.T8), FMC (J6.d26)
DOUT8_P: U_AFE_3 (U1D#1.T8), FMC (J6.k34)
DOUT9_N: U_AFE_0 (U1A#1.U7), FMC (J6.k11)
DOUT9_N: U_AFE_1 (U1B#1.U7), FMC (J6.h17)
DOUT9_N: U_AFE_2 (U1C#1.U7), FMC (J6.c27)
DOUT9_N: U_AFE_3 (U1D#1.U7), FMC (J6.k32)
DOUT9_P: U_AFE_0 (U1A#1.T7), FMC (J6.k10)
DOUT9_P: U_AFE_1 (U1B#1.T7), FMC (J6.h16)
DOUT9_P: U_AFE_2 (U1C#1.T7), FMC (J6.c26)
DOUT9_P: U_AFE_3 (U1D#1.T7), FMC (J6.k31)
DOUT10_N: U_AFE_0 (U1A#1.R6), FMC (J6.f11)
DOUT10_N: U_AFE_1 (U1B#1.R6), FMC (J6.d18)
DOUT10_N: U_AFE_2 (U1C#1.R6), FMC (J6.g25)
DOUT10_N: U_AFE_3 (U1D#1.R6), FMC (J6.e22)
DOUT10_P: U_AFE_0 (U1A#1.R7), FMC (J6.f10)
DOUT10_P: U_AFE_1 (U1B#1.R7), FMC (J6.d17)
DOUT10_P: U_AFE_2 (U1C#1.R7), FMC (J6.g24)
DOUT10_P: U_AFE_3 (U1D#1.R7), FMC (J6.e21)
DOUT11_N: U_AFE_0 (U1A#1.U6), FMC (J6.k8)
DOUT11_N: U_AFE_1 (U1B#1.U6), FMC (J6.g16)
DOUT11_N: U_AFE_2 (U1C#1.U6), FMC (J6.h26)
DOUT11_N: U_AFE_3 (U1D#1.U6), FMC (J6.j28)
DOUT11_P: U_AFE_0 (U1A#1.T6), FMC (J6.k7)
DOUT11_P: U_AFE_1 (U1B#1.T6), FMC (J6.g15)
DOUT11_P: U_AFE_2 (U1C#1.T6), FMC (J6.h25)
DOUT11_P: U_AFE_3 (U1D#1.T6), FMC (J6.j27)
DOUT12_N: U_AFE_0 (U1A#1.U5), FMC (J6.e13)
DOUT12_N: U_AFE_1 (U1B#1.U5), FMC (J6.g10)
DOUT12_N: U_AFE_2 (U1C#1.U5), FMC (J6.d24)
DOUT12_N: U_AFE_3 (U1D#1.U5), FMC (J6.f26)
DOUT12_P: U_AFE_0 (U1A#1.T5), FMC (J6.e12)
DOUT12_P: U_AFE_1 (U1B#1.T5), FMC (J6.g9)
DOUT12_P: U_AFE_2 (U1C#1.T5), FMC (J6.d23)
DOUT12_P: U_AFE_3 (U1D#1.T5), FMC (J6.f25)
DOUT13_N: U_AFE_0 (U1A#1.T4), FMC (J6.e10)
DOUT13_N: U_AFE_1 (U1B#1.T4), FMC (J6.d9)
DOUT13_N: U_AFE_2 (U1C#1.T4), FMC (J6.c23)
DOUT13_N: U_AFE_3 (U1D#1.T4), FMC (J6.j25)
DOUT13_P: U_AFE_0 (U1A#1.R4), FMC (J6.e9)
DOUT13_P: U_AFE_1 (U1B#1.R4), FMC (J6.d8)
DOUT13_P: U_AFE_2 (U1C#1.R4), FMC (J6.c22)
DOUT13_P: U_AFE_3 (U1D#1.R4), FMC (J6.j24)
DOUT14_N: U_AFE_0 (U1A#1.T3), FMC (J6.f8)
DOUT14_N: U_AFE_1 (U1B#1.T3), FMC (J6.h8)
DOUT14_N: U_AFE_2 (U1C#1.T3), FMC (J6.h23)
DOUT14_N: U_AFE_3 (U1D#1.T3), FMC (J6.f23)
DOUT14_P: U_AFE_0 (U1A#1.R3), FMC (J6.f7)
DOUT14_P: U_AFE_1 (U1B#1.R3), FMC (J6.h7)
DOUT14_P: U_AFE_2 (U1C#1.R3), FMC (J6.h22)
DOUT14_P: U_AFE_3 (U1D#1.R3), FMC (J6.f22)
DOUT15_N: U_AFE_0 (U1A#1.T2), FMC (J6.e7)
DOUT15_N: U_AFE_1 (U1B#1.T2), FMC (J6.g7)
DOUT15_N: U_AFE_2 (U1C#1.T2), FMC (J6.g22)
DOUT15_N: U_AFE_3 (U1D#1.T2), FMC (J6.f35)
DOUT15_P: U_AFE_0 (U1A#1.R2), FMC (J6.e6)
DOUT15_P: U_AFE_1 (U1B#1.R2), FMC (J6.g6)
DOUT15_P: U_AFE_2 (U1C#1.R2), FMC (J6.g21)
DOUT15_P: U_AFE_3 (U1D#1.R2), FMC (J6.f34)
EN_PWR: Supply_FMC_ADC128 (IC10.19 R105.1), FMC (J6.k23), EEPROM_Temp (IC38.3 IC39.3)
FCLK_N: U_AFE_0 (U1A#1.R8), FMC (J6.f14)
FCLK_N: U_AFE_1 (U1B#1.R8), FMC (J6.c19)
FCLK_N: U_AFE_2 (U1C#1.R8), FMC (J6.d21)
FCLK_N: U_AFE_3 (U1D#1.R8), FMC (J6.f29)
FCLK_P: U_AFE_0 (U1A#1.R10), FMC (J6.f13)
FCLK_P: U_AFE_1 (U1B#1.R10), FMC (J6.c18)
FCLK_P: U_AFE_2 (U1C#1.R10), FMC (J6.d20)
FCLK_P: U_AFE_3 (U1D#1.R10), FMC (J6.f28)
GA0: FMC (J6.c34), EEPROM_Temp (IC2.2)
GA1: FMC (J6.d35), EEPROM_Temp (IC2.1)
HA19_N: FMC (J6.f20), SPI_translators (IC3.7 R162.2)
HA19_P: FMC (J6.f19), SPI_translators (IC6.8)
HA20_N: FMC (J6.e19), SPI_translators (IC3.9 R164.2)
HA20_P: FMC (J6.e18), SPI_translators (IC3.8 R163.2)
HA21_N: FMC (J6.k20), SPI_translators (IC1.8)
HA21_P: FMC (J6.k19), SPI_translators (IC3.6 R161.2)
HA22_N: FMC (J6.j22), SPI_translators (IC1.9)
HA22_P: FMC (J6.j21), SPI_translators (IC1.6)
HA23_P: FMC (J6.k22), SPI_translators (IC6.9)
HB06_CC_N: CLK_INPUT (IC5.13), FMC (J6.k29)
HB06_CC_P: CLK_INPUT (IC5.12), FMC (J6.k28)
HB20_N: FMC (J6.f38), SPI_translators (IC21.6)
HB20_P: FMC (J6.f37), SPI_translators (IC20.7 IC55.4 R21.1)
HB21_N: FMC (J6.e37), SPI_translators (IC20.6 IC55.3 R158.1)
HB21_P: FMC (J6.e36), SPI_translators (IC6.6)
INP0: FMC_ADC_128CH_10B (J1.1), U_AFE_0 (D2A.6 R22A.1 R24A.1)
INP0: FMC_ADC_128CH_10B (J1.48), U_AFE_1 (D2B.6 R22B.1 R24B.1)
INP0: FMC_ADC_128CH_10B (J1.100), U_AFE_2 (D2C.6 R22C.1 R24C.1)
INP0: FMC_ADC_128CH_10B (J1.149), U_AFE_3 (D2D.6 R22D.1 R24D.1)
INP1: FMC_ADC_128CH_10B (J1.2), U_AFE_0 (D1A.6 R26A.2 R27A.1)
INP1: FMC_ADC_128CH_10B (J1.49), U_AFE_1 (D1B.6 R26B.2 R27B.1)
INP1: FMC_ADC_128CH_10B (J1.101), U_AFE_2 (D1C.6 R26C.2 R27C.1)
INP1: FMC_ADC_128CH_10B (J1.150), U_AFE_3 (D1D.6 R26D.2 R27D.1)
INP2: FMC_ADC_128CH_10B (J1.3), U_AFE_0 (D2A.1 R28A.1 R29A.1)
INP2: FMC_ADC_128CH_10B (J1.50), U_AFE_1 (D2B.1 R28B.1 R29B.1)
INP2: FMC_ADC_128CH_10B (J1.102), U_AFE_2 (D2C.1 R28C.1 R29C.1)
INP2: FMC_ADC_128CH_10B (J1.151), U_AFE_3 (D2D.1 R28D.1 R29D.1)
INP3: FMC_ADC_128CH_10B (J1.4), U_AFE_0 (D1A.1 R30A.2 R31A.1)
INP3: FMC_ADC_128CH_10B (J1.51), U_AFE_1 (D1B.1 R30B.2 R31B.1)
INP3: FMC_ADC_128CH_10B (J1.103), U_AFE_2 (D1C.1 R30C.2 R31C.1)
INP3: FMC_ADC_128CH_10B (J1.152), U_AFE_3 (D1D.1 R30D.2 R31D.1)
INP4: FMC_ADC_128CH_10B (J1.5), U_AFE_0 (D2A.4 R32A.1 R33A.1)
INP4: FMC_ADC_128CH_10B (J1.104), U_AFE_2 (D2C.4 R32C.1 R33C.1)
INP5: FMC_ADC_128CH_10B (J1.6), U_AFE_0 (D1A.4 R34A.2 R35A.1)
INP5: FMC_ADC_128CH_10B (J1.105), U_AFE_2 (D1C.4 R34C.2 R35C.1)
INP6: FMC_ADC_128CH_10B (J1.7), U_AFE_0 (D2A.3 R36A.1 R37A.1)
INP6: FMC_ADC_128CH_10B (J1.106), U_AFE_2 (D2C.3 R36C.1 R37C.1)
INP7: FMC_ADC_128CH_10B (J1.8), U_AFE_0 (D1A.3 R38A.2 R39A.1)
INP7: FMC_ADC_128CH_10B (J1.107), U_AFE_2 (D1C.3 R38C.2 R39C.1)
INP8: FMC_ADC_128CH_10B (J1.9), U_AFE_0 (D4A.6 R40A.1 R41A.1)
INP9: FMC_ADC_128CH_10B (J1.10), U_AFE_0 (D3A.6 R42A.2 R43A.1)
INP10: FMC_ADC_128CH_10B (J1.11), U_AFE_0 (D4A.1 R44A.1 R45A.1)
INP10: FMC_ADC_128CH_10B (J1.58), U_AFE_1 (D4B.1 R44B.1 R45B.1)
INP10: FMC_ADC_128CH_10B (J1.110), U_AFE_2 (D4C.1 R44C.1 R45C.1)
INP10: FMC_ADC_128CH_10B (J1.159), U_AFE_3 (D4D.1 R44D.1 R45D.1)
INP11: FMC_ADC_128CH_10B (J1.12), U_AFE_0 (D3A.1 R46A.2 R47A.1)
INP11: FMC_ADC_128CH_10B (J1.59), U_AFE_1 (D3B.1 R46B.2 R47B.1)
INP11: FMC_ADC_128CH_10B (J1.111), U_AFE_2 (D3C.1 R46C.2 R47C.1)
INP12: FMC_ADC_128CH_10B (J1.13), U_AFE_0 (D4A.4 R48A.1 R49A.1)
INP12: FMC_ADC_128CH_10B (J1.60), U_AFE_1 (D4B.4 R48B.1 R49B.1)
INP12: FMC_ADC_128CH_10B (J1.112), U_AFE_2 (D4C.4 R48C.1 R49C.1)
INP13: FMC_ADC_128CH_10B (J1.14), U_AFE_0 (D3A.4 R50A.2 R51A.1)
INP13: FMC_ADC_128CH_10B (J1.61), U_AFE_1 (D3B.4 R50B.2 R51B.1)
INP13: FMC_ADC_128CH_10B (J1.113), U_AFE_2 (D3C.4 R50C.2 R51C.1)
INP14: FMC_ADC_128CH_10B (J1.15), U_AFE_0 (D4A.3 R52A.1 R53A.1)
INP14: FMC_ADC_128CH_10B (J1.62), U_AFE_1 (D4B.3 R52B.1 R53B.1)
INP14: FMC_ADC_128CH_10B (J1.114), U_AFE_2 (D4C.3 R52C.1 R53C.1)
INP15: FMC_ADC_128CH_10B (J1.16), U_AFE_0 (D3A.3 R54A.2 R55A.1)
INP15: FMC_ADC_128CH_10B (J1.63), U_AFE_1 (D3B.3 R54B.2 R55B.1)
INP15: FMC_ADC_128CH_10B (J1.115), U_AFE_2 (D3C.3 R54C.2 R55C.1)
INP16: FMC_ADC_128CH_10B (J1.17), U_AFE_0 (D6A.6 R56A.1 R57A.1)
INP16: FMC_ADC_128CH_10B (J1.64), U_AFE_1 (D6B.6 R56B.1 R57B.1)
INP16: FMC_ADC_128CH_10B (J1.116), U_AFE_2 (D6C.6 R56C.1 R57C.1)
INP17: FMC_ADC_128CH_10B (J1.18), U_AFE_0 (D5A.6 R58A.2 R59A.1)
INP17: FMC_ADC_128CH_10B (J1.65), U_AFE_1 (D5B.6 R58B.2 R59B.1)
INP17: FMC_ADC_128CH_10B (J1.117), U_AFE_2 (D5C.6 R58C.2 R59C.1)
INP18: FMC_ADC_128CH_10B (J1.19), U_AFE_0 (D6A.1 R60A.1 R61A.1)
INP18: FMC_ADC_128CH_10B (J1.66), U_AFE_1 (D6B.1 R60B.1 R61B.1)
INP18: FMC_ADC_128CH_10B (J1.118), U_AFE_2 (D6C.1 R60C.1 R61C.1)
INP19: FMC_ADC_128CH_10B (J1.20), U_AFE_0 (D5A.1 R62A.2 R63A.1)
INP19: FMC_ADC_128CH_10B (J1.67), U_AFE_1 (D5B.1 R62B.2 R63B.1)
INP19: FMC_ADC_128CH_10B (J1.119), U_AFE_2 (D5C.1 R62C.2 R63C.1)
INP20: FMC_ADC_128CH_10B (J1.21), U_AFE_0 (D6A.4 R64A.1 R65A.1)
INP20: FMC_ADC_128CH_10B (J1.68), U_AFE_1 (D6B.4 R64B.1 R65B.1)
INP20: FMC_ADC_128CH_10B (J1.120), U_AFE_2 (D6C.4 R64C.1 R65C.1)
INP21: FMC_ADC_128CH_10B (J1.22), U_AFE_0 (D5A.4 R66A.2 R67A.1)
INP21: FMC_ADC_128CH_10B (J1.69), U_AFE_1 (D5B.4 R66B.2 R67B.1)
INP21: FMC_ADC_128CH_10B (J1.121), U_AFE_2 (D5C.4 R66C.2 R67C.1)
INP22: FMC_ADC_128CH_10B (J1.23), U_AFE_0 (D6A.3 R68A.1 R69A.1)
INP22: FMC_ADC_128CH_10B (J1.70), U_AFE_1 (D6B.3 R68B.1 R69B.1)
INP22: FMC_ADC_128CH_10B (J1.122), U_AFE_2 (D6C.3 R68C.1 R69C.1)
INP23: FMC_ADC_128CH_10B (J1.24), U_AFE_0 (D5A.3 R70A.2 R71A.1)
INP23: FMC_ADC_128CH_10B (J1.71), U_AFE_1 (D5B.3 R70B.2 R71B.1)
INP23: FMC_ADC_128CH_10B (J1.123), U_AFE_2 (D5C.3 R70C.2 R71C.1)
INP24: FMC_ADC_128CH_10B (J1.25), U_AFE_0 (D8A.6 R72A.1 R73A.1)
INP24: FMC_ADC_128CH_10B (J1.72), U_AFE_1 (D8B.6 R72B.1 R73B.1)
INP24: FMC_ADC_128CH_10B (J1.124), U_AFE_2 (D8C.6 R72C.1 R73C.1)
INP25: FMC_ADC_128CH_10B (J1.26), U_AFE_0 (D7A.6 R74A.2 R75A.1)
INP25: FMC_ADC_128CH_10B (J1.73), U_AFE_1 (D7B.6 R74B.2 R75B.1)
INP25: FMC_ADC_128CH_10B (J1.125), U_AFE_2 (D7C.6 R74C.2 R75C.1)
INP26: FMC_ADC_128CH_10B (J1.27), U_AFE_0 (D8A.1 R76A.1 R77A.1)
INP26: FMC_ADC_128CH_10B (J1.74), U_AFE_1 (D8B.1 R76B.1 R77B.1)
INP26: FMC_ADC_128CH_10B (J1.126), U_AFE_2 (D8C.1 R76C.1 R77C.1)
INP27: FMC_ADC_128CH_10B (J1.28), U_AFE_0 (D7A.1 R78A.2 R79A.1)
INP27: FMC_ADC_128CH_10B (J1.75), U_AFE_1 (D7B.1 R78B.2 R79B.1)
INP27: FMC_ADC_128CH_10B (J1.127), U_AFE_2 (D7C.1 R78C.2 R79C.1)
INP28: FMC_ADC_128CH_10B (J1.29), U_AFE_0 (D8A.4 R80A.1 R81A.1)
INP28: FMC_ADC_128CH_10B (J1.76), U_AFE_1 (D8B.4 R80B.1 R81B.1)
INP28: FMC_ADC_128CH_10B (J1.128), U_AFE_2 (D8C.4 R80C.1 R81C.1)
INP29: FMC_ADC_128CH_10B (J1.30), U_AFE_0 (D7A.4 R82A.2 R83A.1)
INP29: FMC_ADC_128CH_10B (J1.77), U_AFE_1 (D7B.4 R82B.2 R83B.1)
INP29: FMC_ADC_128CH_10B (J1.129), U_AFE_2 (D7C.4 R82C.2 R83C.1)
INP30: FMC_ADC_128CH_10B (J1.31), U_AFE_0 (D8A.3 R84A.1 R85A.1)
INP30: FMC_ADC_128CH_10B (J1.78), U_AFE_1 (D8B.3 R84B.1 R85B.1)
INP30: FMC_ADC_128CH_10B (J1.130), U_AFE_2 (D8C.3 R84C.1 R85C.1)
INP31: FMC_ADC_128CH_10B (J1.32), U_AFE_0 (D7A.3 R86A.2 R87A.1)
INP31: FMC_ADC_128CH_10B (J1.79), U_AFE_1 (D7B.3 R86B.2 R87B.1)
INP31: FMC_ADC_128CH_10B (J1.131), U_AFE_2 (D7C.3 R86C.2 R87C.1)
INP36: FMC_ADC_128CH_10B (J1.52), U_AFE_1 (D2B.4 R32B.1 R33B.1)
INP37: FMC_ADC_128CH_10B (J1.53), U_AFE_1 (D1B.4 R34B.2 R35B.1)
INP38: FMC_ADC_128CH_10B (J1.54), U_AFE_1 (D2B.3 R36B.1 R37B.1)
INP39: FMC_ADC_128CH_10B (J1.55), U_AFE_1 (D1B.3 R38B.2 R39B.1)
INP40: FMC_ADC_128CH_10B (J1.56), U_AFE_1 (D4B.6 R40B.1 R41B.1)
INP41: FMC_ADC_128CH_10B (J1.57), U_AFE_1 (D3B.6 R42B.2 R43B.1)
INP72: FMC_ADC_128CH_10B (J1.108), U_AFE_2 (D4C.6 R40C.1 R41C.1)
INP73: FMC_ADC_128CH_10B (J1.109), U_AFE_2 (D3C.6 R42C.2 R43C.1)
INP100: FMC_ADC_128CH_10B (J1.153), U_AFE_3 (D2D.4 R32D.1 R33D.1)
INP101: FMC_ADC_128CH_10B (J1.154), U_AFE_3 (D1D.4 R34D.2 R35D.1)
INP102: FMC_ADC_128CH_10B (J1.155), U_AFE_3 (D2D.3 R36D.1 R37D.1)
INP103: FMC_ADC_128CH_10B (J1.156), U_AFE_3 (D1D.3 R38D.2 R39D.1)
INP104: FMC_ADC_128CH_10B (J1.157), U_AFE_3 (D4D.6 R40D.1 R41D.1)
INP105: FMC_ADC_128CH_10B (J1.158), U_AFE_3 (D3D.6 R42D.2 R43D.1)
INP107: FMC_ADC_128CH_10B (J1.160), U_AFE_3 (D3D.1 R46D.2 R47D.1)
INP108: FMC_ADC_128CH_10B (J1.161), U_AFE_3 (D4D.4 R48D.1 R49D.1)
INP109: FMC_ADC_128CH_10B (J1.162), U_AFE_3 (D3D.4 R50D.2 R51D.1)
INP110: FMC_ADC_128CH_10B (J1.163), U_AFE_3 (D4D.3 R52D.1 R53D.1)
INP111: FMC_ADC_128CH_10B (J1.164), U_AFE_3 (D3D.3 R54D.2 R55D.1)
INP112: FMC_ADC_128CH_10B (J1.165), U_AFE_3 (D6D.6 R56D.1 R57D.1)
INP113: FMC_ADC_128CH_10B (J1.166), U_AFE_3 (D5D.6 R58D.2 R59D.1)
INP114: FMC_ADC_128CH_10B (J1.167), U_AFE_3 (D6D.1 R60D.1 R61D.1)
INP115: FMC_ADC_128CH_10B (J1.168), U_AFE_3 (D5D.1 R62D.2 R63D.1)
INP116: FMC_ADC_128CH_10B (J1.169), U_AFE_3 (D6D.4 R64D.1 R65D.1)
INP117: FMC_ADC_128CH_10B (J1.170), U_AFE_3 (D5D.4 R66D.2 R67D.1)
INP118: FMC_ADC_128CH_10B (J1.171), U_AFE_3 (D6D.3 R68D.1 R69D.1)
INP119: FMC_ADC_128CH_10B (J1.172), U_AFE_3 (D5D.3 R70D.2 R71D.1)
INP120: FMC_ADC_128CH_10B (J1.173), U_AFE_3 (D8D.6 R72D.1 R73D.1)
INP121: FMC_ADC_128CH_10B (J1.174), U_AFE_3 (D7D.6 R74D.2 R75D.1)
INP122: FMC_ADC_128CH_10B (J1.175), U_AFE_3 (D8D.1 R76D.1 R77D.1)
INP123: FMC_ADC_128CH_10B (J1.176), U_AFE_3 (D7D.1 R78D.2 R79D.1)
INP124: FMC_ADC_128CH_10B (J1.177), U_AFE_3 (D8D.4 R80D.1 R81D.1)
INP125: FMC_ADC_128CH_10B (J1.178), U_AFE_3 (D7D.4 R82D.2 R83D.1)
INP126: FMC_ADC_128CH_10B (J1.179), U_AFE_3 (D8D.3 R84D.1 R85D.1)
INP127: FMC_ADC_128CH_10B (J1.180), U_AFE_3 (D7D.3 R86D.2 R87D.1)
PDN_GBL: FMC_ADC_128CH_10B (R5.2), U_AFE_0 (U1A#1.M16), U_AFE_1 (U1B#1.M16), U_AFE_2 (U1C#1.M16), U_AFE_3 (U1D#1.M16)
PG_M2C: Supply_FMC_ADC128 (IC15.9 R138.2 T2.5), FMC (J6.f1)
RESET: U_AFE_0 (U1A#1.L17), U_AFE_1 (U1B#1.L17), U_AFE_2 (U1C#1.L17), U_AFE_3 (U1D#1.L17), SPI_translators (B24.1 IC1.12)
SCL: FMC_ADC_128CH_10B (J1.45), FMC (J6.c30), EEPROM_Temp (B5.1 IC2.6 R7.1 R114.2)
SCL_2V5: Supply_FMC_ADC128 (IC10.4 IC18.5 IC22.13 J2#1.2), CLK_INPUT (OSC1.8 TP2.1), SPI_translators (IC55.6 R1.1)
SCLK: U_AFE_0 (U1A#1.J17), U_AFE_1 (U1B#1.J17), U_AFE_2 (U1C#1.J17), U_AFE_3 (U1D#1.J17), SPI_translators (B23.1 IC1.13)
SDA: FMC_ADC_128CH_10B (J1.44), FMC (J6.c31), EEPROM_Temp (B14.1 IC2.5 R4.1 R113.2)
SDA_2V5: Supply_FMC_ADC128 (IC10.3 IC18.4 IC22.14 J2#1.3), CLK_INPUT (OSC1.7 TP1.1), SPI_translators (IC55.5 R2.1)
SDIN: U_AFE_0 (U1A#1.L16), U_AFE_1 (U1B#1.L16), U_AFE_2 (U1C#1.L16), U_AFE_3 (U1D#1.L16), SPI_translators (B25.1 IC3.15)
SDOUT: U_AFE_0 (U1A#1.J16), U_AFE_1 (U1B#1.J16), U_AFE_2 (U1C#1.J16), U_AFE_3 (U1D#1.J16), SPI_translators (B22.1 IC1.15)
SENE: U_AFE_0 (U1A#1.K17), SPI_translators (IC4.15 TP6.1)
SENE: U_AFE_1 (U1B#1.K17), SPI_translators (IC4.13)
SENE: U_AFE_2 (U1C#1.K17), SPI_translators (IC4.11)
SENE: U_AFE_3 (U1D#1.K17), SPI_translators (IC4.9)
SENO: U_AFE_0 (U1A#1.K15), SPI_translators (IC4.14)
SENO: U_AFE_1 (U1B#1.K15), SPI_translators (IC4.12)
SENO: U_AFE_2 (U1C#1.K15), SPI_translators (IC4.10)
SENO: U_AFE_3 (U1D#1.K15), SPI_translators (IC4.7)
TX_TRIG: U_AFE_0 (U1A#1.M15), U_AFE_1 (U1B#1.M15), U_AFE_2 (U1C#1.M15), U_AFE_3 (U1D#1.M15), SPI_translators (R20.2)

## Assembly variants
default: not fitted J2 R116 R143 R144 R146 R147